# EAGLE design AvrProgrammerSchematic (EAGLE 7.3.0)
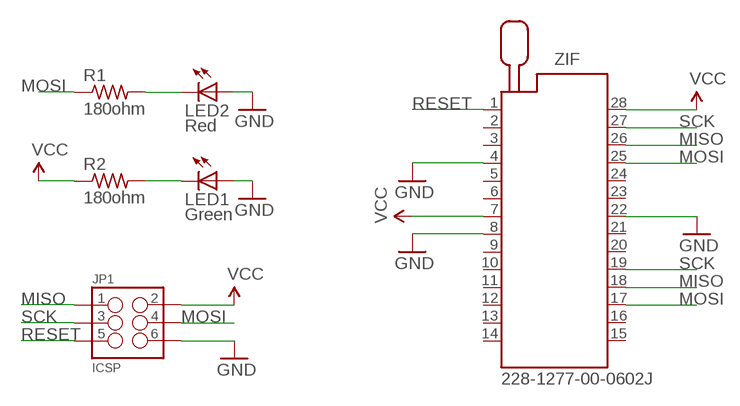
[diagram p0: schematic, sheet 1]

## Parts
JP1  ICSP  M03X2  [2X3_SMD]
LED1  Green  LED3MM  [LED3MM]
LED2  Red  LED3MM  [LED3MM]
R1  180ohm  R-US_0207/7  [0207/7]
R2  180ohm  R-US_0207/7  [0207/7]
ZIF  228-1277-00-0602J  [228-1277-00-0602J]

## Nets
GND: JP1.6 LED1.A LED2.A ZIF.4 ZIF.8 ZIF.22
MISO: JP1.1 ZIF.18 ZIF.26
MOSI: JP1.4 R1.1 ZIF.17 ZIF.25
N$1: LED2.K(C) R1.2
N$2: LED1.K(C) R2.2
RESET: JP1.5 ZIF.1
SCK: JP1.3 ZIF.19 ZIF.27
VCC: JP1.2 R2.1 ZIF.7 ZIF.28
Unconnected: ZIF.2 ZIF.3 ZIF.5 ZIF.6 ZIF.9 ZIF.10 ZIF.11 ZIF.12 ZIF.13 ZIF.14 ZIF.15 ZIF.16 ZIF.20 ZIF.21 ZIF.23 ZIF.24

## Library data of the parts
JP1 = SparkFun-Connectors:M03X2: 2x3 .1" header. Shrouded, with keying- CONN-10681 SMT- CONN-11415 Pogo pins- HW-11044; PROD_ID: CONN-11290
LED1 LED2 = led:LED: LED OSRAM: - CHIPLED LG R971, LG N971, LY N971, LG Q971, LY Q971, LO R971, LY R971 LH N974, LH R974 LS Q976, LO Q976, LY Q976 LO Q996 - Hyper CHIPLED LW Q18S LB Q993, LB Q99A, LB R99A - SideLED LS A670, LO A670, LY A670, LG A670, LP A670 LB A673, LV A673, LT A673, LW A673 LH A674 LY A675 LS A676, LA A676, LO A676, LY A676, LW A676 LS A679, LY A679, LG A679 - Hyper Micro SIDELED® LS Y876, LA Y876, LO Y876, LY Y876 LT Y87S - SmartLED LW L88C, LW L88S LB L89C, LB L89S, LG L890 LS L89K, LO L89K, LY L89K LS L896, LA L896, LO L896, LY L896 - TOPLED LS T670, LO T670, LY T670, LG T670, LP T670 LSG T670, LSP T670, LSY T670, LOP T670, LYG T670 LG T671, LOG T671, LSG T671 LB T673, LV T673, LT T673, LW T673 LH T674 LS T676, LA T676, LO T676, LY T676, LB T676, LH T676, LSB T676, LW T676 LB T67C, LV T67C, LT T67C, LS T67K, LO T67K, LY T67K, LW E67C LS E67B, LA E67B, LO E67B, LY E67B, LB E67C, LV E67C, LT E67C LW T67C LS T679, LY T679, LG T679 LS T770, LO T770, LY T770, LG T770, LP T770 LB T773, LV T773, LT T773, LW T773 LH T774 LS E675, LA E675, LY E675, LS T675 LS T776, LA T776, LO T776, LY T776, LB T776 LHGB T686 LT T68C, LB T68C - Hyper Mini TOPLED® LB M676 - Mini TOPLED Santana® LG M470 LS M47K, LO M47K, LY M47K Source: http://www.osram.convergy.de LUXEON: - LUMILED® LXK2-PW12-R00, LXK2-PW12-S00, LXK2-PW14-U00, LXK2-PW14-V00 LXK2-PM12-R00, LXK2-PM12-S00, LXK2-PM14-U00 LXK2-PE12-Q00, LXK2-PE12-R00, LXK2-PE12-S00, LXK2-PE14-T00, LXK2-PE14-U00 LXK2-PB12-K00, LXK2-PB12-L00, LXK2-PB12-M00, LXK2-PB14-N00, LXK2-PB14-P00, LXK2-PB14-Q00 LXK2-PR12-L00, LXK2-PR12-M00, LXK2-PR14-Q00, LXK2-PR14-R00 LXK2-PD12-Q00, LXK2-PD12-R00, LXK2-PD12-S00 LXK2-PH12-R00, LXK2-PH12-S00 LXK2-PL12-P00, LXK2-PL12-Q00, LXK2-PL12-R00 Source: www.luxeon.com KINGBRIGHT: KA-3528ASYC Source: www.kingbright.com
R1 R2 = rcl:R-US_: RESISTOR, American symbol
ZIF = con-3m:228-?00-0602J: Zero Insertion Force Socked Source: http://www.3M.com/ehpd; MF: 3M; MPN: 228-1277-00-0602J; OC_FARNELL: 9897356; OC_NEWARK: 85K7825

## Board
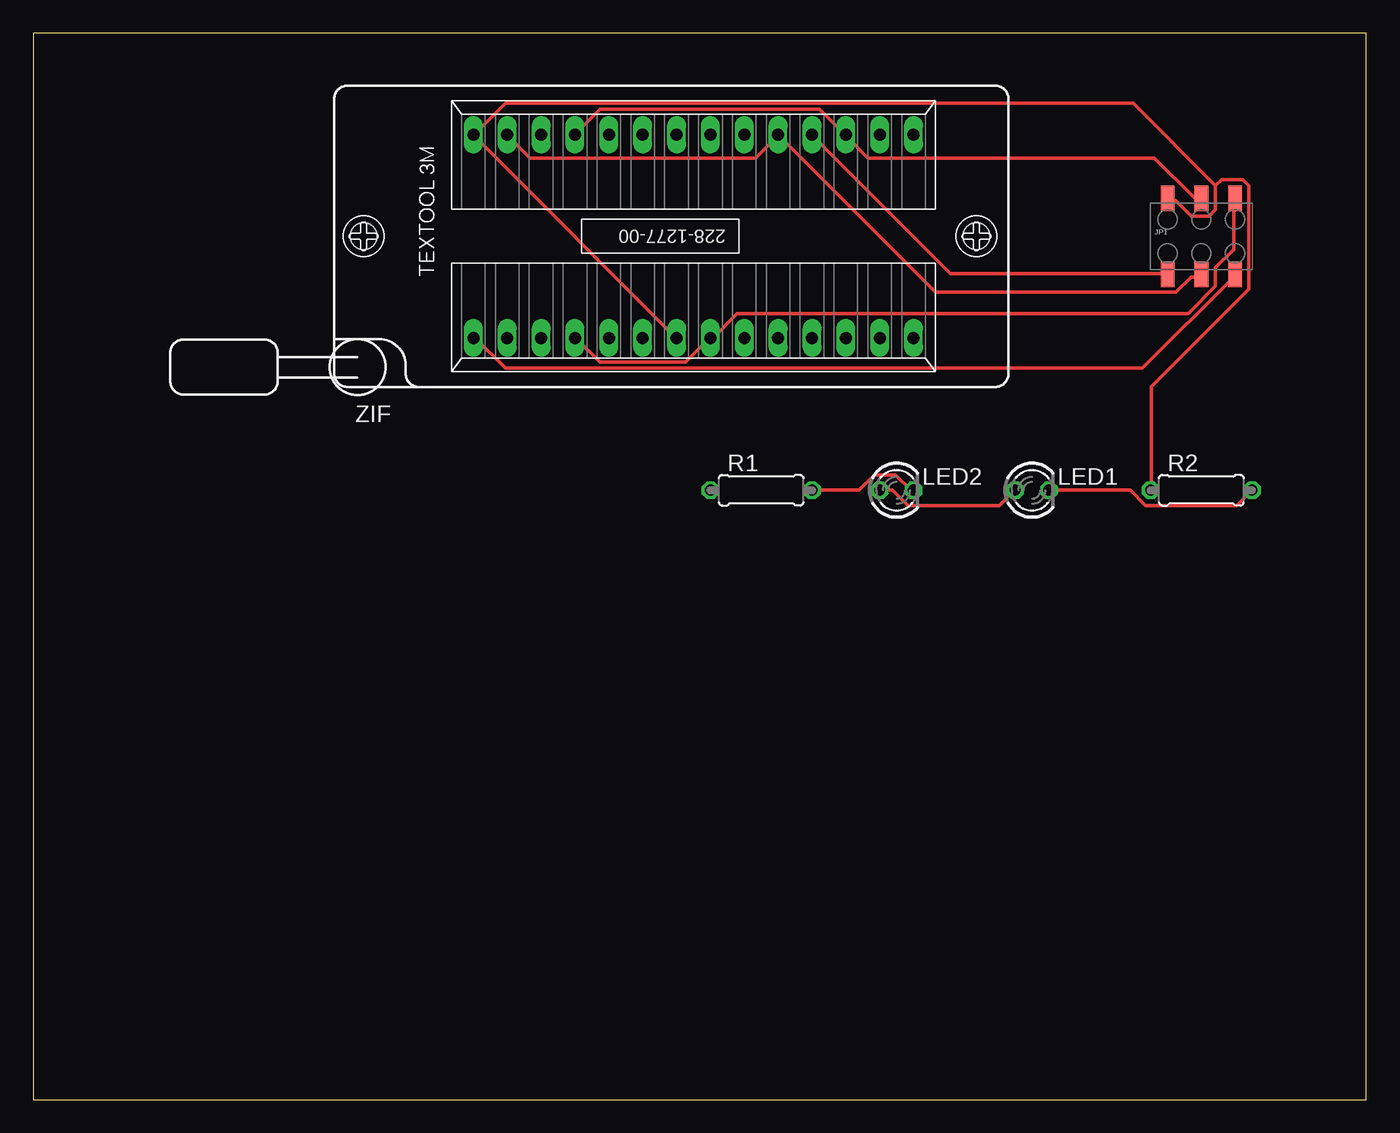
[diagram p1: board, top side]
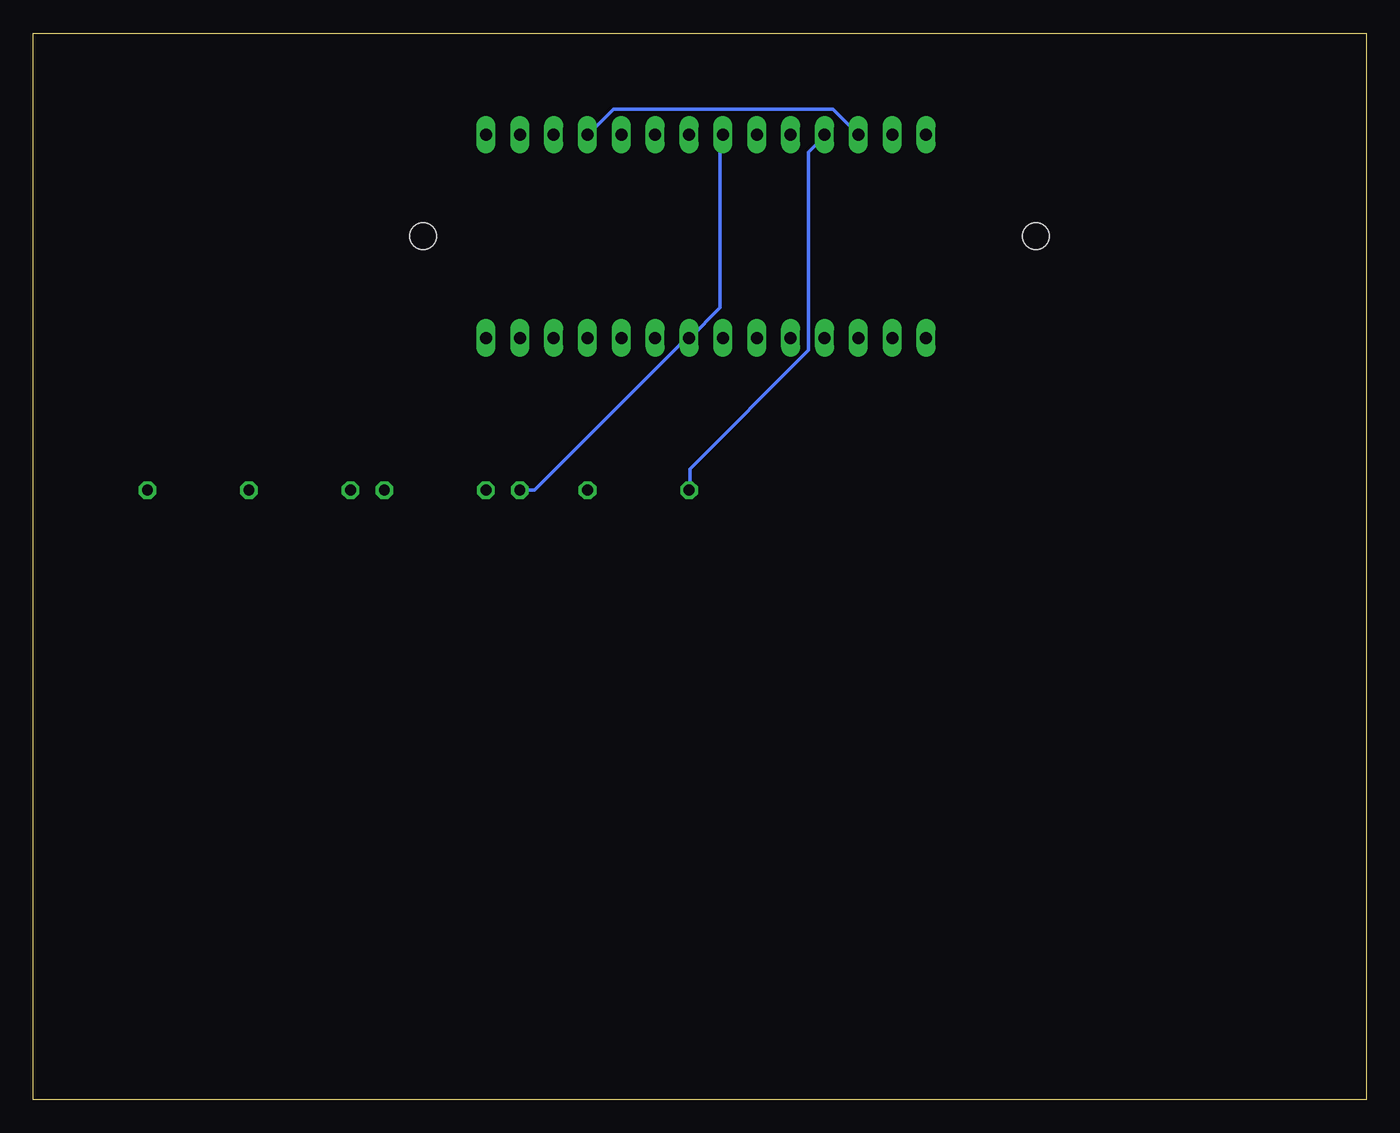
[diagram p2: board, bottom side, seen from below]

Size 100 x 80 mm. Coordinates in mm from the lower left corner, seen from the top.
Outline: 0,0 100,0 100,80 0,80 0,0
Copper layers (1*16): Top 0.035mm / dielectric 1.5mm / Bottom 0.035mm
Design rules "default": minimum track width 10mil, minimum drill 24mil, track to track 8mil, track to pad 8mil, pad to pad 8mil, via to via 8mil, smd to smd 8mil, copper to edge 40mil, drill to drill 8mil, minimum pad ring 10mil, minimum via ring 8mil, stop-mask expansion 4mil, vias tented up to drill 0mil, thermal gap 10mil

### Footprints (pad centres in the part's own frame; a part is rotated, then mirrored left to right if it is on the bottom)
2X3_SMD = smd 1.02 x 1.9: 1 -2.54,-2.85; 2 -2.54,2.85; 3 0,-2.85; 4 0,2.85; 5 2.54,-2.85; 6 2.54,2.85
LED3MM = drill 0.813 octagon: A -1.27,0; K 1.27,0
0207/7 = drill 0.813 octagon: 1 -3.81,0; 2 3.81,0
228-1277-00-0602J = drill 0.9 long: 1 -16.51,-7.62; 2 -13.97,-7.62; 3 -11.43,-7.62; 4 -8.89,-7.62; 5 -6.35,-7.62; 6 -3.81,-7.62; 7 -1.27,-7.62; 8 1.27,-7.62; 9 3.81,-7.62; 10 6.35,-7.62; 11 8.89,-7.62; 12 11.43,-7.62; 13 13.97,-7.62; 14 16.51,-7.62; 15 16.51,7.62; 16 13.97,7.62; 17 11.43,7.62; 18 8.89,7.62; 19 6.35,7.62; 20 3.81,7.62; 21 1.27,7.62; 22 -1.27,7.62; 23 -3.81,7.62; 24 -6.35,7.62; 25 -8.89,7.62; 26 -11.43,7.62; 27 -13.97,7.62; 28 -16.51,7.62 | hole 2: 21.24,0; -24.74,0

### Placement (x,y rotation side)
JP1  87.63,64.77 0 top
LED1  74.93,45.72 0 top
LED2  64.77,45.72 0 top
R1  54.61,45.72 0 top
R2  87.63,45.72 0 top
ZIF  49.53,64.77 0 top

### Tracks (layer width: path | path; a pad name or v marks a point on that pad's centre or on a via)
GND
  Top 0.254: JP1.6 90.07,67.44 90.07,63.78 88.7,62.41 88.7,61.04 86.64,58.98 52.81,58.98 50.98,57.15 ZIF.8 50.75,57.15 48.92,55.32 42.52,55.32 40.69,57.15 ZIF.4 | LED2.A 64.47,45.72 65.61,44.58 72.47,44.58 73.61,45.72 LED1.A
  Bottom 0.254: ZIF.22 48.46,72.24 48.46,59.44 50.75,57.15 ZIF.8 50.98,57.15 62.41,45.72 LED2.A
MISO
  Top 0.254: JP1.1 85.04,61.95 68.81,61.95 58.52,72.24 ZIF.18
  Bottom 0.254: ZIF.26 40.01,74.3 56.46,74.3 58.29,72.47 ZIF.18
MOSI
  Top 0.254: JP1.4 87.55,67.67 87.1,67.67 84.12,70.64 62.64,70.64 61.04,72.24 ZIF.17 60.81,72.47 58.98,74.3 42.52,74.3 40.69,72.47 ZIF.25
  Bottom 0.254: R1.1 50.75,45.72 50.75,47.32 41.83,56.24 41.83,71.09 40.69,72.24 ZIF.25
N$1
  Top 0.254: R1.2 61.95,45.72 63.09,46.86 64.69,46.86 65.84,45.72 LED2.K
N$2
  Top 0.254: LED1.K 82.3,45.72 83.44,44.58 90.3,44.58 R2.2
RESET
  Top 0.254: JP1.5 90.07,61.72 83.21,54.86 35.43,54.86 33.15,57.15 ZIF.1
SCK
  Top 0.254: JP1.3 87.55,61.72 86.87,61.72 85.72,60.58 67.67,60.58 56.01,72.24 ZIF.19 55.78,72.24 54.18,70.64 37.26,70.64 35.66,72.24 ZIF.27
VCC
  Top 0.254: 88.7,68.58 88.7,66.75 88.24,66.29 86.87,66.29 85.72,67.44 85.27,67.44 JP1.2 | 88.7,68.58 82.53,74.75 35.43,74.75 33.15,72.47 ZIF.28 33.15,72.24 48.23,57.15 ZIF.7 | 88.7,68.58 89.15,69.04 90.75,69.04 91.21,68.58 91.21,60.81 83.9,53.49 83.9,45.72 R2.1